# Altium schematic sheet SensorsPower.SchDoc
size C
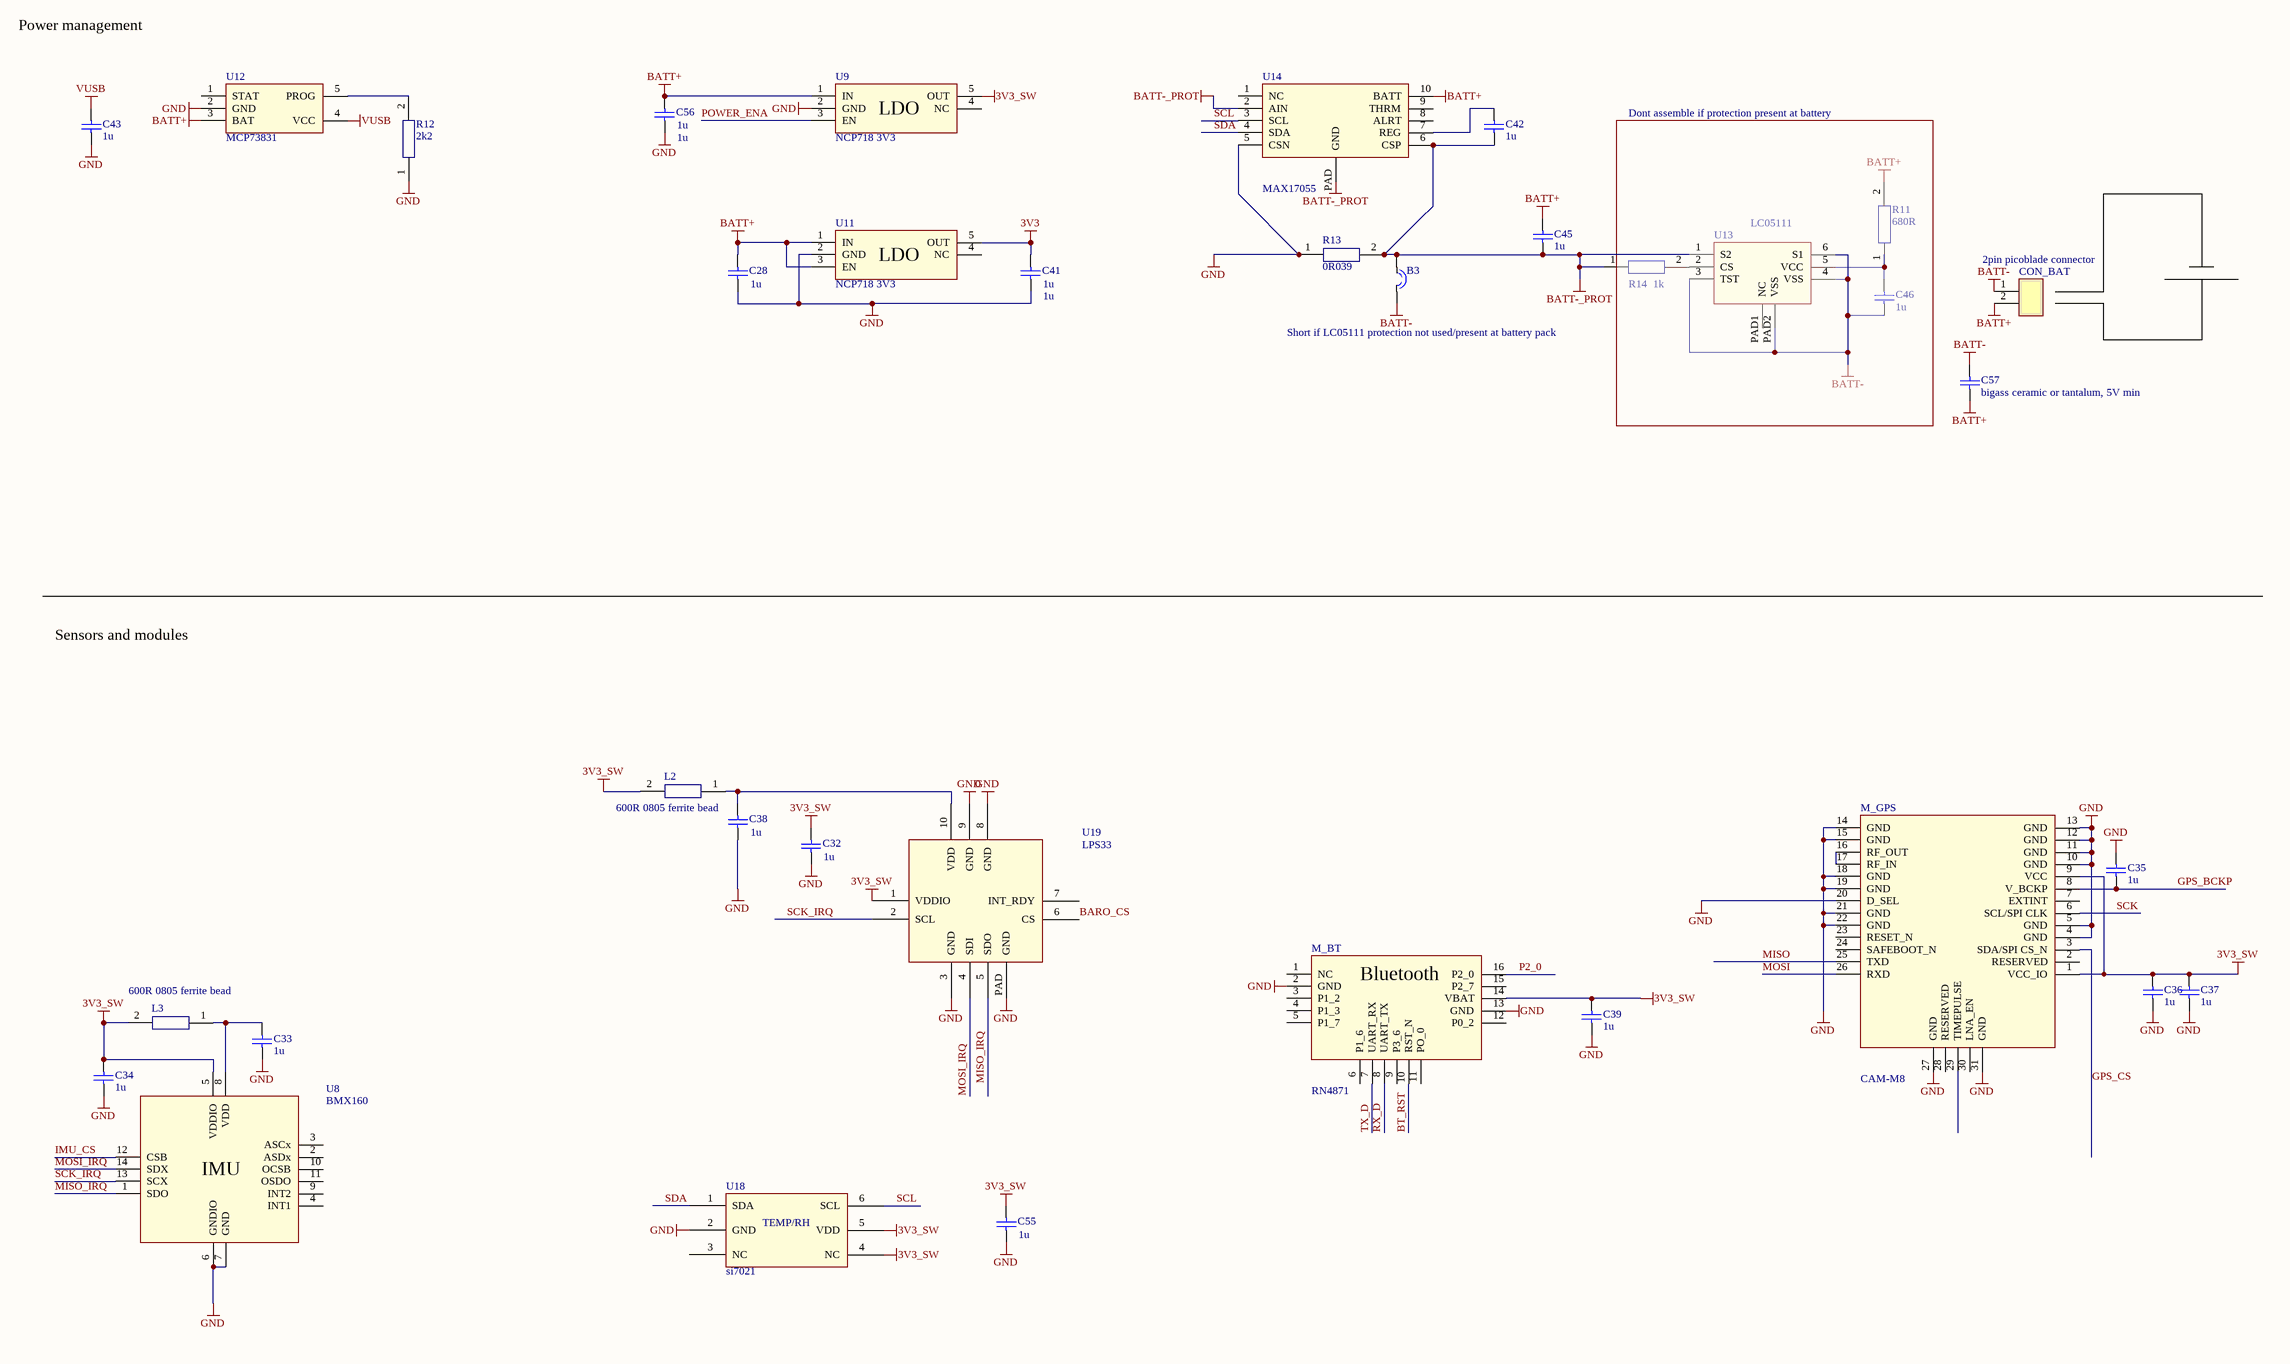
[diagram p0: SensorsPower.SchDoc]

## Parts
B3  Short if LC05111 protection not used/present at battery pack  [Solder_bridge_small]
C28  1u  [cap0603]
C32  1u  [cap0603]
C33  1u  [cap0603]
C34  1u  [cap0603]
C35  1u  [cap0603]
C36  1u  [cap0603]
C37  1u  [cap0603]
C38  1u  [cap0603]
C39  1u  [cap0603]
C41  1u  [cap0603]
C42  1u  [cap0603]
C43  1u  [cap0603]
C45  1u  [cap0603]
C46  1u  [cap0603]
C55  1u  [cap0603]
C56  1u  [cap0603]
C57  bigass ceramic or tantalum, 5V min  [CAP1206]
CON_BAT  2pin picoblade connector  [1x2, 1.25]
L2  600R 0805 ferrite bead  [cap0805]
L3  600R 0805 ferrite bead  [cap0805]
M_BT  RN4871  [RN4871]
M_GPS  CAM-M8  [CAM]
R11  680R  [cap0805]
R12  2k2  [cap0805]
R13  0R039  [cap0805]
R14  1k  [cap0805]
U8  BMX160  [LGA14 3*2.5]
U9  NCP718 3V3  [sot23-5]
U11  NCP718 3V3  [sot23-5]
U12  MCP73831  [sot23-5]
U13  LC05111  [wdfn6_dual_flag]
U14  MAX17055  [tdfn10_ep]
U18  si7021  [dfn6]
U19  LPS33  [LPS33]

## Blocks framed on the sheet
Dont assemble if protection present at battery: C46 R11 R14 U13

## Nets
3V3: C41.2 U11.5(OUT)
3V3_SW: C32.2 C34.2 C36.1 C37.1 C39.1 C55.2 L2.2 L3.2 M_BT.14(VBAT) M_GPS.1(VCC_IO) M_GPS.9(VCC) U8.5(VDDIO) U9.5(OUT) U18.4(NC) U18.5(VDD) U19.1(VDDIO)
BATT+: C28.2 C45.2 C56.2 C57.1 CON_BAT.2 R11.2 U9.1(IN) U11.1(IN) U11.3(EN) U12.3(BAT) U14.10(BATT)
BATT-: B3.1 C46.1 C57.2 CON_BAT.1 U13.3(TST) U13.4(VSS) U13.6(S1) U13.PAD2(VSS)
BATT-_PROT: B3.2 C42.1 C45.1 R13.2 R14.1 U13.1(S2) U14.2(AIN) U14.6(CSP) U14.PAD(GND)
GND: C28.1 C32.1 C33.1 C34.1 C35.1 C36.2 C37.2 C38.1 C39.2 C41.1 C43.1 C55.1 C56.1 M_BT.2(GND) M_BT.13(GND) M_GPS.4(GND) M_GPS.5(GND) M_GPS.10(GND) M_GPS.11(GND) M_GPS.12(GND) M_GPS.13(GND) M_GPS.14(GND) M_GPS.15(GND) M_GPS.18(GND) M_GPS.19(GND) M_GPS.20(D_SEL) M_GPS.21(GND) M_GPS.22(GND) M_GPS.27(GND) M_GPS.31(GND) R12.1 R13.1 U8.6(GNDIO) U8.7(GND) U9.2(GND) U11.2(GND) U12.2(GND) U14.5(CSN) U18.2(GND) U19.3(GND) U19.8(GND) U19.9(GND) U19.PAD(GND)
VUSB: C43.2 U12.4(VCC)
BARO_CS: U19.6(CS)
BT_RST: M_BT.10(RST_N)
GPS_BCKP: C35.2 M_GPS.8(V_BCKP)
GPS_CS: M_GPS.3(SDA/SPI_CS_N)
IMU_CS: U8.12(CSB)
MISO: M_GPS.25(TXD)
MISO_IRQ: U8.1(SDO) U19.5(SDO)
MOSI: M_GPS.26(RXD)
MOSI_IRQ: U8.14(SDX) U19.4(SDI)
P2_0: M_BT.16(P2_0)
POWER_ENA: U9.3(EN)
RX_D: M_BT.8(UART_TX)
SCK: M_GPS.6(SCL/SPI_CLK)
SCK_IRQ: U8.13(SCX) U19.2(SCL)
SCL: U14.3(SCL) U18.6(SCL)
SDA: U14.4(SDA) U18.1(SDA)
TX_D: M_BT.7(UART_RX)
NetC33_2: C33.2 L3.1 U8.8(VDD)
NetC38_2: C38.2 L2.1 U19.10(VDD)
NetC42_2: C42.2 U14.7(REG)
NetC46_2: C46.2 R11.1 U13.5(VCC)
NetM_GPS_16: M_GPS.16(RF_OUT) M_GPS.17(RF_IN)
NetR12_2: R12.2 U12.5(PROG)
NetR14_2: R14.2 U13.2(CS)

Not connected (* = marked no-connect by the designer): M_BT 1(NC) 3(P1_2) 4(P1_3) 5(P1_7) 6(P1_6) 9(P3_6) 11(PO_0) 12(P0_2) 15(P2_7); M_GPS 2(RESERVED) 7(EXTINT) 23(RESET_N) 24(SAFEBOOT_N) 28(RESERVED) 29(TIMEPULSE) 30(LNA_EN); U8 2(ASDx) 3(ASCx) 4(INT1) 9(INT2) 10(OCSB) 11(OSDO); U9 4(NC); U11 4(NC); U12 1(STAT); U13 PAD1(NC); U14 1(NC) 8(ALRT) 9(THRM); U18 3(NC); U19 7(INT_RDY)

## Notes on the sheet
- Power management
- Sensors and modules
- (in symbol BMX160) IMU
- (in symbol LDLN025 LDO) LDO
- (in symbol RN4871) Bluetooth
- (in symbol SHT21) TEMP/RH

## Library data of the parts
B3 = Solder_bridge: Solder bridge
C28 C32-C39 C41-C43 C45 C46 C55 C56 = Cap: 0603; Published: 8-Jun-2000; LatestRevisionDate: 17-Jul-2002; LatestRevisionNote: Re-released for DXP Platform.; PackageReference: RAD-0.3; Publisher: Altium Limited; PackageDescription: Radial Cap, Thru-Hole; 2 Leads; 0.3 in Pin Spacing; Value: 1u
C57 = Cap: 1206; Value: something big, probably tantalum; Published: 8-Jun-2000; LatestRevisionDate: 17-Jul-2002; LatestRevisionNote: Re-released for DXP Platform.; PackageReference: RAD-0.3; Publisher: Altium Limited; PackageDescription: Radial Cap, Thru-Hole; 2 Leads; 0.3 in Pin Spacing
CON_BAT = 1x2 Header, 2.54
L2 L3 R11-R14 = Resistor1: 0805; Value: =Value
M_BT = RN4871: bluetooth module
M_GPS = CAM-M8: u-blox CAM GNSS antenna module; Manufacturer: u-blox; Part Description: u-blox CAM GNSS antenna module; Value: CAM-M8
U8 = BMX160: IMU mems unit
U9 U11 = LDLN025 LDO: SOT23 3.3V LDO regulator
U12 = MCP73831: SOT23 linear battery charging controller
U13 = LC05111: Battery protection circuit
U14 = MAX17055: Battery monitoring gauge
U18 = SHT21: temp and humidity sensor
U19 = LPS33: barometer